# EAGLE design control_board_MCU (EAGLE 6.3)
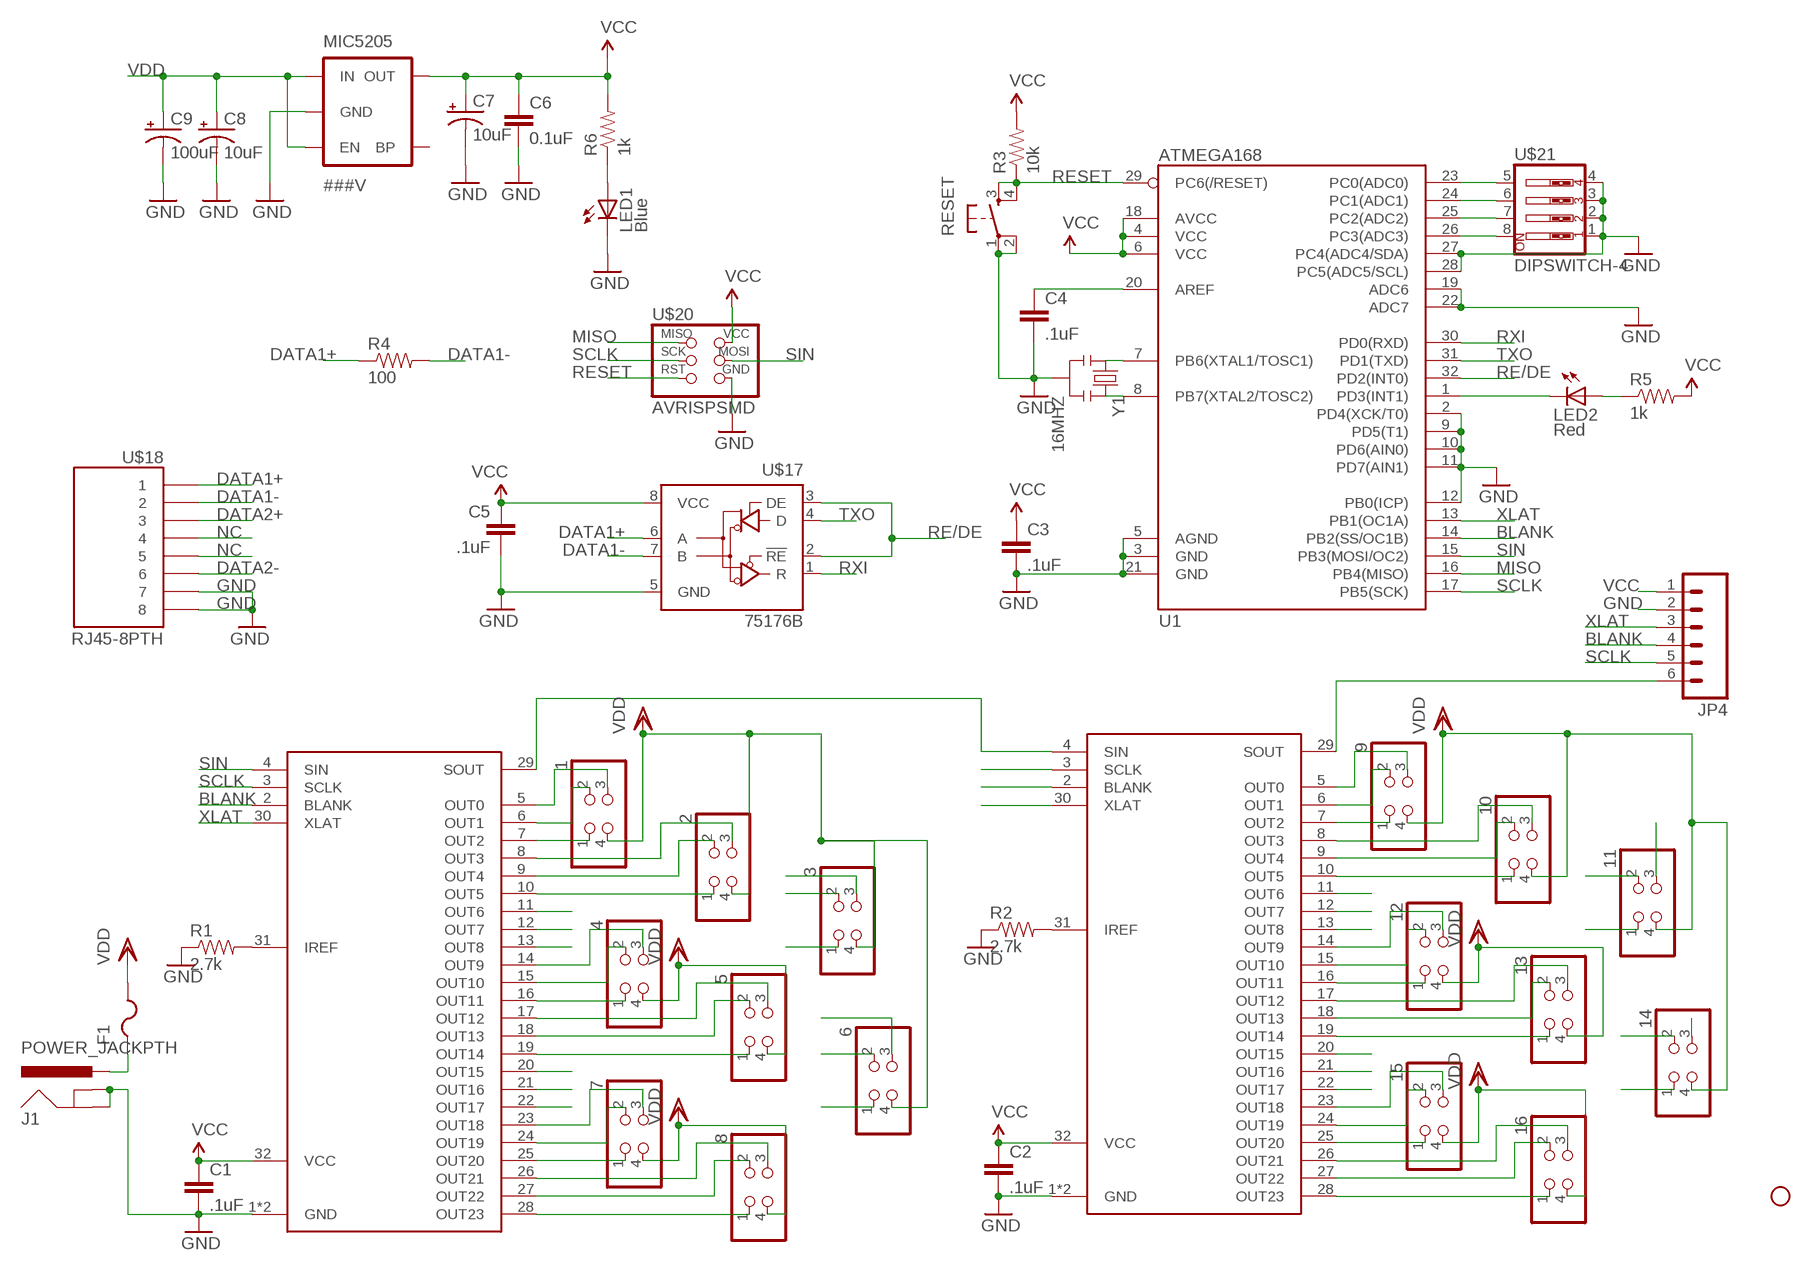
[diagram p0: schematic, sheet 1]

## Parts
1  PINHD-2X2  [2X02]
2  PINHD-2X2  [2X02]
3  PINHD-2X2  [2X02]
4  PINHD-2X2  [2X02]
5  PINHD-2X2  [2X02]
6  PINHD-2X2  [2X02]
7  PINHD-2X2  [2X02]
8  PINHD-2X2  [2X02]
9  PINHD-2X2  [2X02]
10  PINHD-2X2  [2X02]
11  PINHD-2X2  [2X02]
12  PINHD-2X2  [2X02]
13  PINHD-2X2  [2X02]
14  PINHD-2X2  [2X02]
15  PINHD-2X2  [2X02]
16  PINHD-2X2  [2X02]
C1  .1uF  CAP0402-CAP  [0402-CAP]
C2  .1uF  CAP0402-CAP  [0402-CAP]
C3  .1uF  CAP0402-CAP  [0402-CAP]
C4  .1uF  CAP0402-CAP  [0402-CAP]
C5  .1uF  CAP0402-CAP  [0402-CAP]
C6  0.1uF  CAP0402-CAP  [0402-CAP]
C7  10uF  CAP_POL1206  [EIA3216]
C8  10uF  CAP_POL1206  [EIA3216]
C9  100uF  CAP_POLC  [PANASONIC_C]
F1  PTCFUSE-1812  [1812]
J1  POWER_JACKPTH  [POWER_JACK_PTH]
JP4  M06LOCK  [1X06_LOCK]
LED1  Blue  LED0603  [LED-0603]
LED2  Red  LED0603  [LED-0603]
MIC5205  ###V  V_REG_LDOSMD  [SOT23-5]
R1  2.7k  RESISTOR0603-RES  [0603-RES]
R2  2.7k  RESISTOR0603-RES  [0603-RES]
R3  10k  RESISTOR0402-RES  [0402-RES]
R4  100  RESISTOR1206  [1206]
R5  1k  RESISTOR0402  [C0402]
R6  1k  RESISTOR0402  [C0402]
RESET  TAC_SWITCHSMD  [TACTILE_SWITCH_SMD]
STANDOFF1  STAND-OFF  [STAND-OFF]
TLC5947  TLC5947DAP  [DAP]
TLC5947-2  TLC5947DAP  [DAP]
U1  ATMEGA168  [TQFP32-08]
U$17  75176B  [D_R-PDSO-G8]
U$18  RJ45-8PTH  [RJ45-8]
U$20  AVRISPSMD  [2X03SMD]
U$21  DIPSWITCH-4  [DIPSWITCH-04]
Y1  16MHZ  RESONATOR8MHZ  [RESONATOR-SMD]

## Nets
BLANK: JP4.4 TLC5947-2.2(BLANK) TLC5947.2(BLANK) U1.14(PB2(SS/OC1B))
DATA1+: R4.1 U$17.6(A) U$18.1
DATA1-: R4.2 U$17.7(B) U$18.2
DATA2+: U$18.3
DATA2-: U$18.6
GND: C1.2 C2.2 C3.2 C4.2 C5.2 C6.2 C7.C(-) C8.C(-) C9.- J1.GND J1.GNDBREAK JP4.2 LED1.C MIC5205.2(GND) R1.1 R2.1 RESET.1 RESET.2 TLC5947-2.1(GND) TLC5947-2.GND TLC5947.1(GND) TLC5947.GND U1.2(PD4(XCK/T0)) U1.3(GND) U1.5(AGND) U1.9(PD5(T1)) U1.10(PD6(AIN0)) U1.11(PD7(AIN1)) U1.12(PB0(ICP)) U1.19(ADC6) U1.21(GND) U1.22(ADC7) U1.27(PC4(ADC4/SDA)) U1.28(PC5(ADC5/SCL)) U$17.5(GND) U$18.7 U$18.8 U$20.6(GND) U$21.1 U$21.2 U$21.3 U$21.4 Y1.2
MISO: U1.16(PB4(MISO)) U$20.1(MISO)
N$1: R1.2 TLC5947.31(IREF)
N$2: R2.2 TLC5947-2.31(IREF)
N$3: C4.1 U1.20(AREF)
N$4: U1.7(PB6(XTAL1/TOSC1)) Y1.1
N$5: U1.8(PB7(XTAL2/TOSC2)) Y1.3
N$6: LED2.C U1.1(PD3(INT1))
N$7: LED2.A R5.1
N$8: F1.1 J1.PWR
N$9: 1.1 TLC5947.7(OUT2)
N$10: U1.23(PC0(ADC0)) U$21.5
N$11: U1.24(PC1(ADC1)) U$21.6
N$12: U1.25(PC2(ADC2)) U$21.7
N$13: U1.26(PC3(ADC3)) U$21.8
N$14: 1.2 TLC5947.6(OUT1)
N$38: LED1.A R6.1
NC: U$18.4 U$18.5
OUT0: 1.3 TLC5947.5(OUT0)
OUT3: 2.3 TLC5947.8(OUT3)
OUT4: 2.2 TLC5947.9(OUT4)
OUT5: 2.1 TLC5947.10(OUT5)
OUT6: 3.3 TLC5947.11(OUT6)
OUT7: 3.2 TLC5947.12(OUT7)
OUT8: 3.1 TLC5947.13(OUT8)
OUT9: 4.3 TLC5947.14(OUT9)
OUT10: 4.2 TLC5947.15(OUT10)
OUT11: 4.1 TLC5947.16(OUT11)
OUT12: 5.3 TLC5947.17(OUT12)
OUT13: 5.2 TLC5947.18(OUT13)
OUT14: 5.1 TLC5947.19(OUT14)
OUT15: 6.3 TLC5947.20(OUT15)
OUT16: 6.2 TLC5947.21(OUT16)
OUT17: 6.1 TLC5947.22(OUT17)
OUT18: 7.3 TLC5947.23(OUT18)
OUT19: 7.2 TLC5947.24(OUT19)
OUT20: 7.1 TLC5947.25(OUT20)
OUT21: 8.3 TLC5947.26(OUT21)
OUT22: 8.2 TLC5947.27(OUT22)
OUT23: 8.1 TLC5947.28(OUT23)
OUT24: 9.3 TLC5947-2.5(OUT0)
OUT25: 9.2 TLC5947-2.6(OUT1)
OUT26: 9.1 TLC5947-2.7(OUT2)
OUT27: 10.3 TLC5947-2.8(OUT3)
OUT28: 10.2 TLC5947-2.9(OUT4)
OUT29: 10.1 TLC5947-2.10(OUT5)
OUT30: 11.3 TLC5947-2.11(OUT6)
OUT31: 11.2 TLC5947-2.12(OUT7)
OUT32: 11.1 TLC5947-2.13(OUT8)
OUT33: 12.3 TLC5947-2.14(OUT9)
OUT34: 12.2 TLC5947-2.15(OUT10)
OUT35: 12.1 TLC5947-2.16(OUT11)
OUT36: 13.3 TLC5947-2.17(OUT12)
OUT37: 13.2 TLC5947-2.18(OUT13)
OUT38: 13.1 TLC5947-2.19(OUT14)
OUT39: 14.3 TLC5947-2.20(OUT15)
OUT40: 14.2 TLC5947-2.21(OUT16)
OUT41: 14.1 TLC5947-2.22(OUT17)
OUT42: 15.3 TLC5947-2.23(OUT18)
OUT43: 15.2 TLC5947-2.24(OUT19)
OUT44: 15.1 TLC5947-2.25(OUT20)
OUT45: 16.3 TLC5947-2.26(OUT21)
OUT46: 16.2 TLC5947-2.27(OUT22)
OUT47: 16.1 TLC5947-2.28(OUT23)
RE/DE: U1.32(PD2(INT0)) U$17.2(!RE) U$17.3(DE)
RESET: R3.1 RESET.3 RESET.4 U1.29(PC6(/RESET)) U$20.5(RST)
RXI: U1.30(PD0(RXD)) U$17.1(R)
SCLK: JP4.5 TLC5947-2.3(SCLK) TLC5947.3(SCLK) U1.17(PB5(SCK)) U$20.3(SCK)
SIN: TLC5947.4(SIN) U1.15(PB3(MOSI/OC2)) U$20.4(MOSI)
SOUT: TLC5947-2.4(SIN) TLC5947.29(SOUT)
SOUT1: JP4.6 TLC5947-2.29(SOUT)
TXO: U1.31(PD1(TXD)) U$17.4(D)
VCC: C1.1 C2.1 C3.1 C5.1 C6.1 C7.A(+) JP4.1 MIC5205.5(OUT) R3.2 R5.2 R6.2 TLC5947-2.32(VCC) TLC5947.32(VCC) U1.4(VCC) U1.6(VCC) U1.18(AVCC) U$17.8(VCC) U$20.2(VCC)
VDD: 1.4 2.4 3.4 4.4 5.4 6.4 7.4 8.4 9.4 10.4 11.4 12.4 13.4 14.4 15.4 16.4 C8.A(+) C9.+ F1.2 MIC5205.1(IN) MIC5205.3(EN)
XLAT: JP4.3 TLC5947-2.30(XLAT) TLC5947.30(XLAT) U1.13(PB1(OC1A))
Unconnected: MIC5205.4(BP)

## Library data of the parts
1-16 = pinhead:PINHD-2X2: PIN HEADER
C1-C6 = SparkFun-Capacitors:CAP: Capacitor Standard 0603 ceramic capacitor, and 0.1" leaded capacitor.
C7 C8 = SparkFun:CAP_POL: Capacitor Polarized These are standard SMD and PTH capacitors. Normally 10uF, 47uF, and 100uF in electrolytic and tantalum varieties. Always verify the external diameter of the through hole cap, it varies with capacity, voltage, and manufacturer. The EIA devices should be standard.
C9 = SparkFun-Capacitors:CAP_POL: Capacitor Polarized These are standard SMD and PTH capacitors. Normally 10uF, 47uF, and 100uF in electrolytic and tantalum varieties. Always verify the external diameter of the through hole cap, it varies with capacity, voltage, and manufacturer. The EIA devices should be standard.
F1 = adafruit:PTCFUSE: PTC fuses, resettable thermistors
J1 = SparkFun-Connectors:POWER_JACK: Power Jack This is the standard 5.5mm barrel jack for power. The PTH is the most common, proven, reliable, footprint. The Slot footprint only works if the mill layer is transmitted to the PCB fab house so be warned. Spark Fun Electronics SKU : PRT-00119 SMT: CONN-08106 Mating wall wart : TOL-00298 (and others)
JP4 = SparkFun-Connectors:M06: Header 6 Standard 6-pin 0.1" header. Use with straight break away headers (SKU : PRT-00116), right angle break away headers (PRT-00553), swiss pins (PRT-00743), machine pins (PRT-00117), and female headers (PRT-00115). Molex polarized connector foot print use with SKU : PRT-08094 with associated crimp pins and housings. NOTES ON THE VARIANTS LOCK and LOCK_LONGPADS... This footprint was designed to help hold the alignment of a through-hole component (i.e. 6-pin header) while soldering it into place. You may notice that each hole has been shifted either up or down by 0.005 of an inch from it's more standard position (which is a perfectly straight line). This slight alteration caused the pins (the squares in the middle) to touch the edges of the holes. Because they are alternating, it causes a "brace" to hold the component in place. 0.005 has proven to be the perfect amount of "off-center" position when using our standard breakaway headers. Although looks a little odd when you look at the bare footprint, once you have a header in there, the alteration is very hard to notice. Also, if you push a header all the way into place, it is covered up entirely on the bottom side. This idea of altering the position of holes to aid alignment will be further integrated into the Sparkfun Library for other footprints. It can help hold any component with 3 or more connection pins.
LED1 LED2 = SparkFun:LED: LEDs Standard schematic elements and footprints for 5mm, 3mm, 1206, and 0603 sized LEDs. 5mm - Spark Fun Electronics SKU : COM-00529 (and others)
MIC5205 = SparkFun:V_REG_LDO: Voltage Regulator LDO Standard 150mA LDO voltage regulator in SOT-23 layout. Micrel part MIC5205. BP (by-pass) pin is used to lower output noise with 470pF cap.
R1 R2 = SparkFun-Resistors:RESISTOR: Resistor
R3 R4 = SparkFun-Passives:RESISTOR: Resistor
R5 R6 = SparkFun:RESISTOR: Resistor
RESET = SparkFun-Electromechanical:TAC_SWITCH: Momentary Switch Button commonly used for reset or general input. Spark Fun Electronics SKU : COM-00097 SMT- SWCH-08247; PROD_ID: SWCH-08247
STANDOFF1 = SparkFun-Electromechanical:STAND-OFF: #4 Stand Off This is the mechanical footprint for a #4 phillips button head screw. Use the keepout ring to avoid running the screw head into surrounding components. SKU : PRT-00447
TLC5947 TLC5947-2 = SparkFun-DigitalIC:TLC5947
U1 = SparkFun-DigitalIC:ATMEGA168: Atmel 32-pin 8-bit micro, 16k flash.
U$17 = 751xx:75176B: 75176B
U$18 = SparkFun-Connectors:RJ45-8: RJ45 Jack Simple RJ45, 8-pin connection - connector for common Cat5, Cat5e, and Cat6 Ethernet cables. Footprint not yet proven in production. Connector sku is PRT-00643; Breakout PCB sku is BOB-00716.
U$20 = fab:AVRISP
U$21 = SparkFun-Electromechanical:DIPSWITCH-4
Y1 = SparkFun-FreqCtrl:RESONATOR: Resonator Small SMD resonator. Used, eg, on the Arduino Pro/ Pro Mini boards. 8MHz- XTAL-08895 16MHz- XTAL-08900; PROD_ID: XTAL-08895; VALUE: 8MHZ

## Net classes
1 vcc: width 0.254 mm

## Board
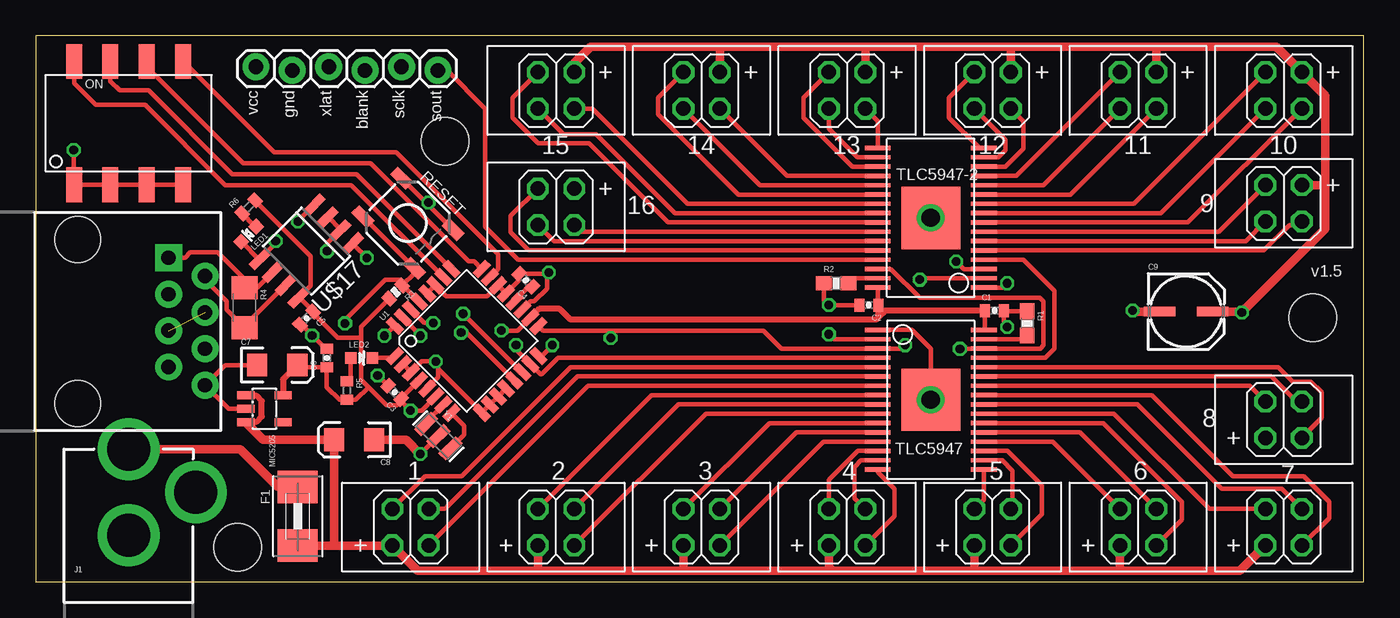
[diagram p1: board, top side]
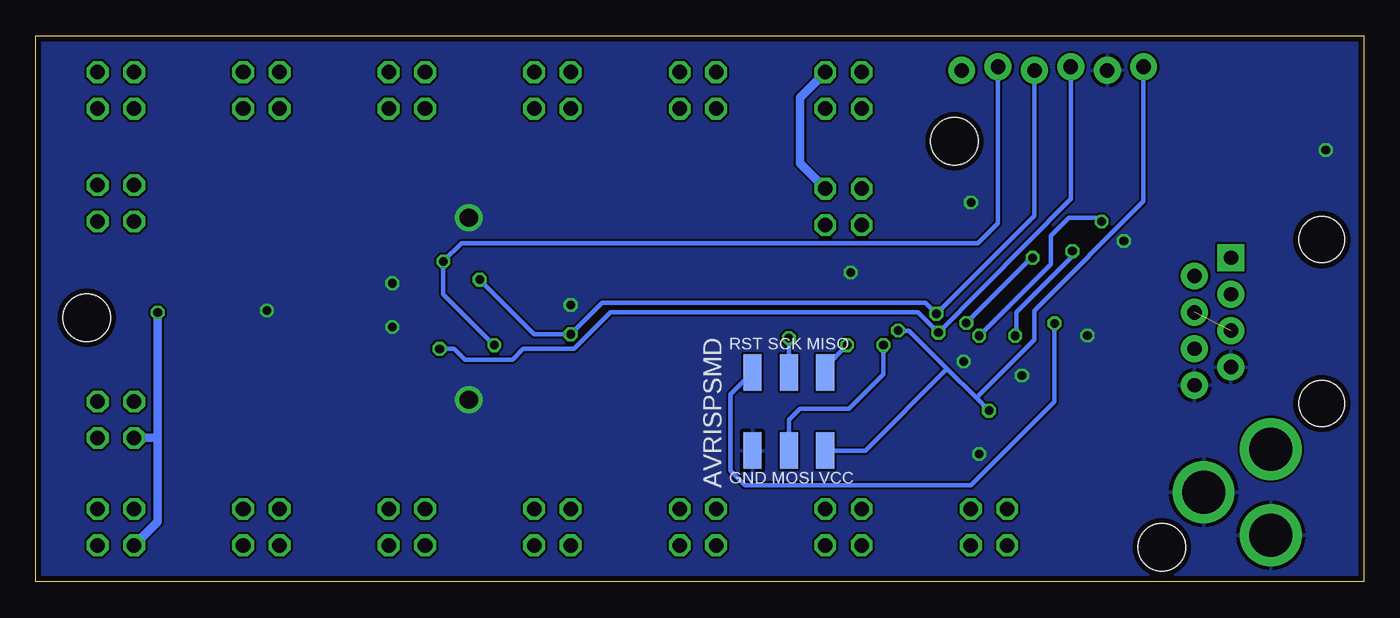
[diagram p2: board, bottom side, seen from below]

Size 92.71 x 38.1 mm. Coordinates in mm from the lower left corner, seen from the top.
Outline: 0,0 92.71,0 92.71,38.1 0,38.1 0,0
Copper layers (1*16): Top 0.0356mm / dielectric 1.5011mm / Bottom 0.0356mm
Design rules "LaenPCBOrder": minimum track width 6mil, minimum drill 13mil, track to track 6mil, track to pad 6mil, pad to pad 6mil, via to via 6mil, smd to smd 6mil, copper to edge 15mil, drill to drill 6mil, minimum pad ring 7mil, minimum via ring 7mil, stop-mask expansion 4mil, vias tented up to drill 0mil, thermal gap 10mil

### Footprints (pad centres in the part's own frame; a part is rotated, then mirrored left to right if it is on the bottom)
2X02 = drill 1.016 octagon: 1 -1.27,1.27; 2 -1.27,-1.27; 3 1.27,-1.27; 4 1.27,1.27
0402-CAP = smd 0.7 x 0.9: 1 -0.65,0; 2 0.65,0
EIA3216 = smd 1.4 x 1.6: A 1.4,0; C -1.4,0
PANASONIC_C = smd 2.2 x 0.65: + 1.9,-0.2; - -1.8,-0.2
1812 = smd 2.286 x 2.794: 1 -2.046,0; 2 2.046,0
POWER_JACK_PTH = drill 2.997 pad 4.318: GND 0,7.7; GNDBREAK 4.7,10.7; PWR 0,13.7
1X06_LOCK = drill 1.016 pad 1.88: 1 0,0; 2 2.54,-0.254; 3 5.08,0; 4 7.62,-0.254; 5 10.16,0; 6 12.7,-0.254
LED-0603 = smd 0.8 x 0.8: A 0,-0.75; C 0,0.75
SOT23-5 = smd 0.55 x 1.2: 1 -0.95,-1.3; 2 0,-1.3; 3 0.95,-1.3; 4 0.95,1.3; 5 -0.95,1.3
0603-RES = smd 1.1 x 1: 1 -0.85,0; 2 0.85,0
0402-RES = smd 0.7 x 0.9: 1 -0.65,0; 2 0.65,0
1206 = smd 1.6 x 1.8: 1 -1.4,0; 2 1.4,0
C0402 = smd 0.7 x 0.9: 1 -0.65,0; 2 0.65,0
TACTILE_SWITCH_SMD = smd 1.524 x 0.762: 1 -2.54,1.905; 2 2.54,1.905; 3 -2.54,-1.905; 4 2.54,-1.905
STAND-OFF = hole 3.302: 0,0
DAP = smd 0.3 x 1.8: 1 -4.875,-3.7; 2 -4.225,-3.7; 3 -3.575,-3.7; 4 -2.925,-3.7; 5 -2.275,-3.7; 6 -1.625,-3.7; 7 -0.975,-3.7; 8 -0.325,-3.7; 9 0.325,-3.7; 10 0.975,-3.7; 11 1.625,-3.7; 12 2.275,-3.7; 13 2.925,-3.7; 14 3.575,-3.7; 15 4.225,-3.7; 16 4.875,-3.7; 17 4.875,3.7; 18 4.225,3.7; 19 3.575,3.7; 20 2.925,3.7; 21 2.275,3.7; 22 1.625,3.7; 23 0.975,3.7; 24 0.325,3.7; 25 -0.325,3.7; 26 -0.975,3.7; 27 -1.625,3.7; 28 -2.275,3.7; 29 -2.925,3.7; 30 -3.575,3.7; 31 -4.225,3.7; 32 -4.875,3.7 | smd 4.36 x 4.11: GND 0,0
TQFP32-08 = smd 1.27 x 0.559: 1 -4.293,2.8; 2 -4.293,2; 3 -4.293,1.2; 4 -4.293,0.4; 5 -4.293,-0.4; 6 -4.293,-1.2; 7 -4.293,-2; 8 -4.293,-2.8; 17 4.293,-2.8; 18 4.293,-2; 19 4.293,-1.2; 20 4.293,-0.4; 21 4.293,0.4; 22 4.293,1.2; 23 4.293,2; 24 4.293,2.8 | smd 0.559 x 1.27: 9 -2.8,-4.293; 10 -2,-4.293; 11 -1.2,-4.293; 12 -0.4,-4.293; 13 0.4,-4.293; 14 1.2,-4.293; 15 2,-4.293; 16 2.8,-4.293; 25 2.8,4.293; 26 2,4.293; 27 1.2,4.293; 28 0.4,4.293; 29 -0.4,4.293; 30 -1.2,4.293; 31 -2,4.293; 32 -2.8,4.293
D_R-PDSO-G8 = smd 0.6 x 1.5: 1 -1.905,-2.75; 2 -0.635,-2.75; 3 0.635,-2.75; 4 1.905,-2.75; 5 1.905,2.75; 6 0.635,2.75; 7 -0.635,2.75; 8 -1.905,2.75
RJ45-8 = drill 1 pad 1.88 square: 1 -4.445,6.35 | drill 1 pad 1.88: 2 -3.175,8.89; 3 -1.905,6.35; 4 -0.635,8.89; 5 0.635,6.35; 6 1.905,8.89; 7 3.175,6.35; 8 4.445,8.89 | hole 3.2: -5.715,0; 5.715,0
2X03SMD = smd 2.54 x 1.27: 1 -2.54,2.54; 2 2.92,2.54; 3 -2.54,0; 4 2.92,0; 5 -2.54,-2.54; 6 2.92,-2.54
DIPSWITCH-04 = smd 1.118 x 2.438: 1 -3.81,-4.305; 2 -1.27,-4.305; 3 1.27,-4.305; 4 3.81,-4.305; 5 3.81,4.305; 6 1.27,4.305; 7 -1.27,4.305; 8 -3.81,4.305
RESONATOR-SMD = smd 0.7 x 1.7: 1 -1.2,0; 2 0,0; 3 1.2,0

### Placement (x,y rotation side)
1  26.16,3.81 180 top
2  36.32,3.81 180 top
3  46.48,3.81 180 top
4  56.64,3.81 180 top
5  66.8,3.81 180 top
6  76.96,3.81 180 top
7  87.12,3.81 180 top
8  87.12,11.3 180 top
9  87.12,26.42 0 top
10  87.12,34.29 0 top
11  76.96,34.29 0 top
12  66.8,34.29 0 top
13  56.64,34.29 0 top
14  46.48,34.29 0 top
15  36.32,34.29 0 top
16  36.32,26.16 0 top
C1  66.93,18.92 0 top
C2  58.17,19.3 180 top
C3  25.05,13.22 135 top
C4  34.21,21.04 135 top
C5  18.9,18.4 225 top
C6  20.32,15.62 90 top
C7  16.86,15.12 0 top
C8  22.23,9.91 180 top
C9  80.26,19.05 0 top
F1  18.29,4.57 270 top
J1  6.48,-4.45 0 top
JP4  15.37,35.94 0 top
LED1  14.86,24.26 135 top
LED2  22.73,15.62 270 top
MIC5205  15.96,12.07 270 top
R1  69.22,18.03 270 top
R2  55.88,20.83 0 top
R3  25.12,20.22 225 top
R4  14.58,19.13 270 top
R5  21.72,13.34 270 top
R6  14.86,26.16 45 top
RESET  25.98,25.03 315 top
STANDOFF1  28.57,30.73 0 top
STANDOFF2  STAND-OFF  [STAND-OFF]  14.1,2.41 0 top
STANDOFF4  STAND-OFF  [STAND-OFF]  89.15,18.41 0 top
TLC5947  62.48,12.7 270 top
TLC5947-2  62.48,25.4 90 top
U1  30.08,16.81 45 top
U$17  18.9,23.07 135 top
U$18  2.92,18.16 270 top
U$20  40.13,12.06 270 bottom
U$21  6.48,32 0 top
Y1  28.1,10.16 315 top

### Tracks (layer width: path | path; a pad name or v marks a point on that pad's centre or on a via)
BLANK  (via drill 0.6)
  Top 0.305: TLC5947.2 55.72,16.93 v55.37,17.27 | U1.14 33.89,14.62 33.89,14.64 v29.83,18.7 | TLC5947-2.2 61.81,21.18 v61.72,21.08
  Bottom 0.305: v61.72,21.08 57.91,17.27 v55.37,17.27 53.18,19.47 30.59,19.47 v29.83,18.7 22.99,25.55 JP4.4
DATA1+
  Top 0.305: 16.49,21.57 U$17.6 15.46,20.53 R4.1 14.58,21.11 12.7,22.99 10.79,22.99 10.41,22.61 U$18.1
DATA1-
  Top 0.305: U$18.2 11.81,21.08 13.34,19.56 13.34,18.97 R4.2 14.46,17.73 U$17.7
GND  (via drill 0.6, 1.27)
  Top 0.305: TLC5947.1 61.16,17.57 62.48,16.26 TLC5947.GND | R2.1 55.03,19.65 v55.37,19.3 C2.2 | U1.5 28.1,14.27 28.1,14.86 | 28.1,14.86 28.1,15.19 v27.92,15.37 26.94,15.37 U1.3 U1.2 | C3.2 v23.86,14.4 | Y1.2 v26.84,8.9 | RESET.2 27.33,26.38 | 27.33,26.38 RESET.1 | v27.42,26.46 27.33,26.38 | v16.75,23.79 16.75,23.61 U$17.5 14.36,23.73 LED1.C | v67.82,17.78 67.58,18.02 C1.2 67.62,18.88 R1.1 | C5.2 18.55,17.94 v19.29,17.19 20.28,16.21 C6.2 | TLC5947-2.1 67.52,20.52 v67.82,20.83 | U$21.4 U$21.3 U$21.2 U$21.1 2.65,27.72 v2.65,30.14 | U1.12 U1.11 U1.10 U1.9 31.13,11.83 28.1,14.86 | U1.28 U1.27 28.64,19.94 31.5,19.94 32.25,20.69 U1.22 U1.21 33.75,21.05 C4.2 35.73,21.5 v35.81,21.59 35.69,21.46 35.69,20.45 34.8,19.56 34.54,19.56 33.98,18.99 U1.19 | C7.C 13.22,15.12 U$18.8 13.46,12.07 MIC5205.2
  Top 0.61: 26.72,8.78 v26.84,8.9 25.84,9.91 C8.C | C9.- 76.65,18.85 v76.58,18.92
  other vias: 62.48,12.7 62.48,25.4
  pour Bottom: 0,0 0,38.1 92.71,38.1 92.71,0
MISO  (via drill 0.6)
  Top 0.305: U1.16 35.31,15.75 v36.07,16.51
  Bottom 0.305: U$20.1 37.59,14.99 v36.07,16.51
N$1
  Top 0.305: TLC5947.31 68.96,16.93 R1.2
N$2
  Top 0.305: TLC5947-2.31 57.08,21.18 R2.2
N$3
  Top 0.305: U1.20 34.42,20.58 C4.1
N$4
  Top 0.305: U1.7 27.25,11.15 Y1.1
N$5
  Top 0.305: Y1.3 29.9,10.26 29.9,10.88 29.02,11.76 U1.8
N$6
  Top 0.305: LED2.C 25.06,15.62 U1.1
N$7
  Top 0.305: R5.1 21.98,13.98 LED2.A
N$8
  Top 0.61: J1.PWR 14.25,9.26 16.89,6.62 F1.1
N$9
  Top 0.305: TLC5947.7 38.57,13.68 1.1
N$10
  Top 0.305: U1.23 32.26,21.82 32.26,22.86 25.16,29.96 16.64,29.96 U$21.5
N$11
  Top 0.305: U$21.6 7.75,35.43 8.26,35.43 14.48,29.21 23.37,29.21 30.23,22.35 30.6,22.35 U1.24
N$12
  Top 0.305: U1.25 22.4,28.45 13.72,28.45 7.87,34.29 5.84,34.29 5.21,34.92 U$21.7
N$13
  Top 0.305: U1.26 22.03,27.69 13.21,27.69 7.62,33.27 4.19,33.27 2.67,34.8 U$21.8
N$14
  Top 0.305: TLC5947.6 37.82,14.32 28.57,5.08 1.2
N$38
  Top 0.305: LED1.A 15.25,24.79 15.25,24.85 R6.1
NC  (1 unrouted)
OUT0
  Top 0.305: TLC5947.5 37.33,14.97 29.72,7.37 27.18,7.37 1.3
OUT3
  Top 0.305: TLC5947.8 43,13.03 2.3
OUT4
  Top 0.305: TLC5947.9 44.89,12.38 2.2
OUT5
  Top 0.305: TLC5947.10 46.78,11.72 2.1
OUT6
  Top 0.305: TLC5947.11 51.21,11.07 3.3
OUT7
  Top 0.305: TLC5947.12 53.1,10.43 3.2
OUT8
  Top 0.305: TLC5947.13 54.99,9.78 3.1
OUT9
  Top 0.305: TLC5947.14 57.38,9.12 55.37,7.11 4.3
OUT10
  Top 0.305: TLC5947.15 57.62,8.47 57.15,8 57.15,5.84 4.2
OUT11
  Top 0.305: TLC5947.16 58.78,7.64 59.94,6.48 59.94,4.57 4.1
OUT12
  Top 0.305: TLC5947.17 66.18,5.73 5.3
OUT13
  Top 0.305: TLC5947.18 67.47,8.47 68.2,7.75 68.2,5.21 5.2
OUT14
  Top 0.305: TLC5947.19 67.84,9.12 70.23,6.73 70.23,4.7 5.1
OUT15
  Top 0.305: TLC5947.20 71,9.78 6.3
OUT16
  Top 0.305: TLC5947.21 72.89,10.43 6.2
OUT17
  Top 0.305: TLC5947.22 74.52,11.07 80.01,5.59 80.01,4.32 6.1
OUT18
  Top 0.305: TLC5947.23 75.27,11.72 81.92,5.08 7.3
OUT19
  Top 0.305: TLC5947.24 76.91,12.38 82.8,6.48 87,6.48 7.2
OUT20
  Top 0.305: TLC5947.25 77.91,13.03 83.57,7.37 88.52,7.37 90.3,5.59 90.3,4.45 7.1
OUT21
  Top 0.305: TLC5947.26 84.75,13.68 8.3
OUT22
  Top 0.305: TLC5947.27 86.26,14.32 87.88,12.7 88.27,12.7 8.2
OUT23
  Top 0.305: TLC5947.28 86.75,14.97 87.76,13.97 89.03,13.97 89.79,13.21 89.79,11.43 8.1
OUT24
  Top 0.305: TLC5947-2.5 85.74,23.12 87.5,24.89 88.14,24.89 9.3
OUT25
  Top 0.305: TLC5947-2.6 84.48,23.77 9.2
OUT26
  Top 0.305: TLC5947-2.7 82.59,24.43 9.1
OUT27
  Top 0.305: TLC5947-2.8 80.45,25.07 10.3
OUT28
  Top 0.305: TLC5947-2.9 78.56,25.73 10.2
OUT29
  Top 0.305: TLC5947-2.10 76.67,26.38 10.1
OUT30
  Top 0.305: TLC5947-2.11 72.24,27.02 11.3
OUT31
  Top 0.305: TLC5947-2.12 70.35,27.68 11.2
OUT32
  Top 0.305: TLC5947-2.13 68.46,28.32 11.1
OUT33
  Top 0.305: TLC5947-2.14 67.71,28.98 68.96,30.23 68.96,32.13 12.3
OUT34
  Top 0.305: TLC5947-2.15 67.22,29.62 67.69,30.1 67.69,30.86 12.2
OUT35
  Top 0.305: TLC5947-2.16 65.86,30.27 63.75,32.38 63.75,33.78 12.1
OUT36
  Top 0.305: TLC5947-2.17 58.78,32.15 13.3
OUT37
  Top 0.305: TLC5947-2.18 57.37,29.62 55.37,31.62 13.2
OUT38
  Top 0.305: TLC5947-2.19 57,28.98 53.59,32.38 53.59,33.78 13.1
OUT39
  Top 0.305: TLC5947-2.20 52.45,28.32 14.3
OUT40
  Top 0.305: TLC5947-2.21 50.56,27.68 14.2
OUT41
  Top 0.305: TLC5947-2.22 49.05,27.02 43.43,32.64 43.43,33.78 14.1
OUT42
  Top 0.305: TLC5947-2.23 45.51,26.38 38.86,33.02 15.3
OUT43
  Top 0.305: TLC5947-2.24 44.63,25.73 39.12,31.24 36.83,31.24 15.2
OUT44
  Top 0.305: TLC5947-2.25 44.14,25.07 38.61,30.61 35.05,30.61 33.27,32.38 33.27,33.78 15.1
OUT45
  Top 0.305: TLC5947-2.26 38.06,24.43 16.3
OUT46
  Top 0.305: TLC5947-2.27 36.17,23.77 16.2
OUT47
  Top 0.305: TLC5947-2.28 34.41,23.12 33.15,24.38 33.15,25.53 16.1
RE/DE  (via drill 0.6)
  Top 0.305: U$17.3 U$17.2 20.34,23.61 v20.34,23.07 | U1.32 24.37,17.17 v24.33,17.17
  Bottom 0.305: v20.34,23.07 20.34,22.71 24.26,18.8 24.26,17.24 v24.33,17.17
RESET  (via drill 0.6)
  Top 0.305: 26.73,19.56 U1.29 25.72,20.59 R3.1 | 25.6,20.82 R3.1 | RESET.3 RESET.4 26.43,21.53 R3.1 | R3.1 25.72,20.92 | v21.59,18.03 21.59,18.29 24.38,21.08 25.46,21.08 R3.1
  Bottom 0.305: v21.59,18.03 21.59,12.57 27.43,6.73 43.18,6.73 44.2,7.75 44.2,13.08 U$20.5
RXI  (via drill 0.6)
  Top 0.305: U1.30 27.12,18.07 v27.74,18.07 | U$17.1 22.19,23.53 v23.11,22.61
  Bottom 0.305: v23.11,22.61 23.2,22.61 v27.74,18.07
SCLK  (via drill 0.6)
  Top 0.305: v60.71,16.51 60.47,16.27 TLC5947.3 52.05,16.27 50.8,17.53 40.01,17.53 | TLC5947-2.3 64.79,21.82 v64.26,22.35 | 40.01,17.53 35.43,17.53 U1.17 | v40.13,17.02 40.13,17.4 40.01,17.53
  Bottom 0.305: v60.71,16.51 64.26,20.07 v64.26,22.35 62.99,23.62 26.92,23.62 25.53,25.02 JP4.5 | U$20.3 v40.13,17.02
SIN  (via drill 0.6)
  Top 0.305: TLC5947.4 36.45,15.62 35.31,14.48 35.23,14.48 U1.15 33.53,16.18 v33.53,16.51
  Bottom 0.305: v33.53,16.51 33.53,14.48 35.94,12.06 39.37,12.06 40.13,11.3 U$20.4
SOUT
  Top 0.305: TLC5947-2.4 68.97,22.48 71.12,20.32 71.12,16.26 70.49,15.62 TLC5947.29
SOUT1
  Top 0.305: TLC5947-2.29 33.66,22.48 31.37,24.77 31.37,33.02 28.7,35.69 JP4.6
TXO  (via drill 0.6)
  Top 0.305: U1.31 26.84,17.21 v26.84,17.17 | U$17.4 v18.29,25.15
  Bottom 0.305: v26.84,17.17 21.84,22.17 21.84,24.13 20.57,25.4 18.54,25.4 v18.29,25.15
VCC  (via drill 0.6)
  Top 0.305: 58.78,19.07 C2.1 58.78,19.34 TLC5947-2.32 | U1.4 26.73,14.05 C3.1 25.51,12.6 | 23.24,13.59 22.71,14.11 22.71,17.02 | 23.24,13.59 24.51,12.32 25.23,12.32 25.51,12.6 | C1.1 66.28,17.67 TLC5947.32 | 22.71,17.02 22.71,17.81 R3.2 | 25.51,12.6 25.51,12.59 v26.16,11.94 26.92,11.94 27.89,12.9 U1.6 | v32.51,17.53 33.62,17.53 U1.18 | 22.71,17.02 21.08,17.02 19.36,18.74 C5.1 18.44,19.78 U$17.8 19.18,20.65 19.18,22.73 15.32,26.59 R6.2 | 37.34,18.29 50.53,18.29 | 23.24,13.59 22.34,12.69 R5.2 21.7,12.7 21.21,12.7 20.32,13.59 C6.1 18.42,14.97 C7.A
  Top 0.406: C1.1 59.31,18.92 58.8,18.41 | 58.8,18.41 58.67,18.29 37.34,18.29 36.58,19.05 35.15,19.05 U1.18 | 58.78,19.07 58.78,18.43 58.8,18.41 | C7.A 17.27,14.13 MIC5205.5
  Bottom 0.305: v32.51,17.53 31.75,17.53 29.08,14.86 | 29.08,14.86 27.05,12.83 | 27.05,12.83 v26.16,11.94 | U$20.2 34.8,9.14 29.08,14.86 | JP4.1 15.37,26.54 22.99,18.92 22.99,16.89 27.05,12.83
VDD  (via drill 0.6)
  Top 0.406: MIC5205.3 14.72,11.17 15.43,11.17 15.79,11.53 15.79,12.61 15.43,12.97 15.07,12.97 15.02,13.02 MIC5205.1
  Top 0.61: 35.18,0.76 26.67,0.76 1.4 24.88,2.53 20.83,2.53 | 35.18,0.76 45.34,0.76 | 45.34,0.76 55.63,0.76 | 55.63,0.76 65.53,0.76 | 65.53,0.76 75.82,0.76 | 75.82,0.76 84.07,0.76 7.4 | 6.4 75.69,0.89 75.82,0.76 | 5.4 65.53,0.76 | 4.4 55.37,1.02 55.63,0.76 | 3.4 45.21,0.89 45.34,0.76 | 2.4 35.05,0.89 35.18,0.76 | 15.4 37.59,36.2 38.73,37.34 47.75,37.34 | 47.75,37.34 57.91,37.34 | 57.91,37.34 67.94,37.34 | 67.94,37.34 78.11,37.34 | 78.11,37.34 86.61,37.34 10.4 90.04,33.91 90.04,27.81 | 11.4 78.23,37.21 78.11,37.34 | 12.4 68.07,37.21 67.94,37.34 | 13.4 57.91,37.34 | 14.4 47.75,37.34 | v84.2,18.8 90.04,24.64 90.04,27.81 | 14.76,11.03 MIC5205.3 15.88,9.91 C8.A 20.82,2.53 20.83,2.53 | 9.4 89.92,27.69 90.04,27.81 | F1.2 20.83,2.53 | v84.2,18.8 | C9.+ 84.15,18.85 v84.2,18.8
  Bottom 0.61: 15.4 39.37,33.78 39.37,29.21 16.4 | 7.4 84.2,4.19 84.2,10.03 | 84.2,10.03 v84.2,18.8 | 8.4 84.2,10.03
XLAT  (via drill 0.6)
  Top 0.305: v64.52,16.26 64.53,16.27 TLC5947.30 70.12,16.27 70.36,16.51 70.36,19.56 70.1,19.81 61.72,19.81 59.71,21.82 TLC5947-2.30 | v29.69,17.38 30.07,17.38 U1.13
  Bottom 0.305: v64.52,16.26 63.5,16.26 62.74,15.49 59.44,15.49 58.67,16.26 55.12,16.26 52.58,18.8 31.11,18.8 v29.7,17.38 v29.69,17.38 20.46,26.69 20.45,26.7 JP4.3

### Text on the board
tPlace: vcc / gnd / xlat / blank / sclk / sout | v1.5
bNames: RST SCK MISO / / / / / GND MOSI VCC